# EAGLE design minimal_arduino (EAGLE 6.2)
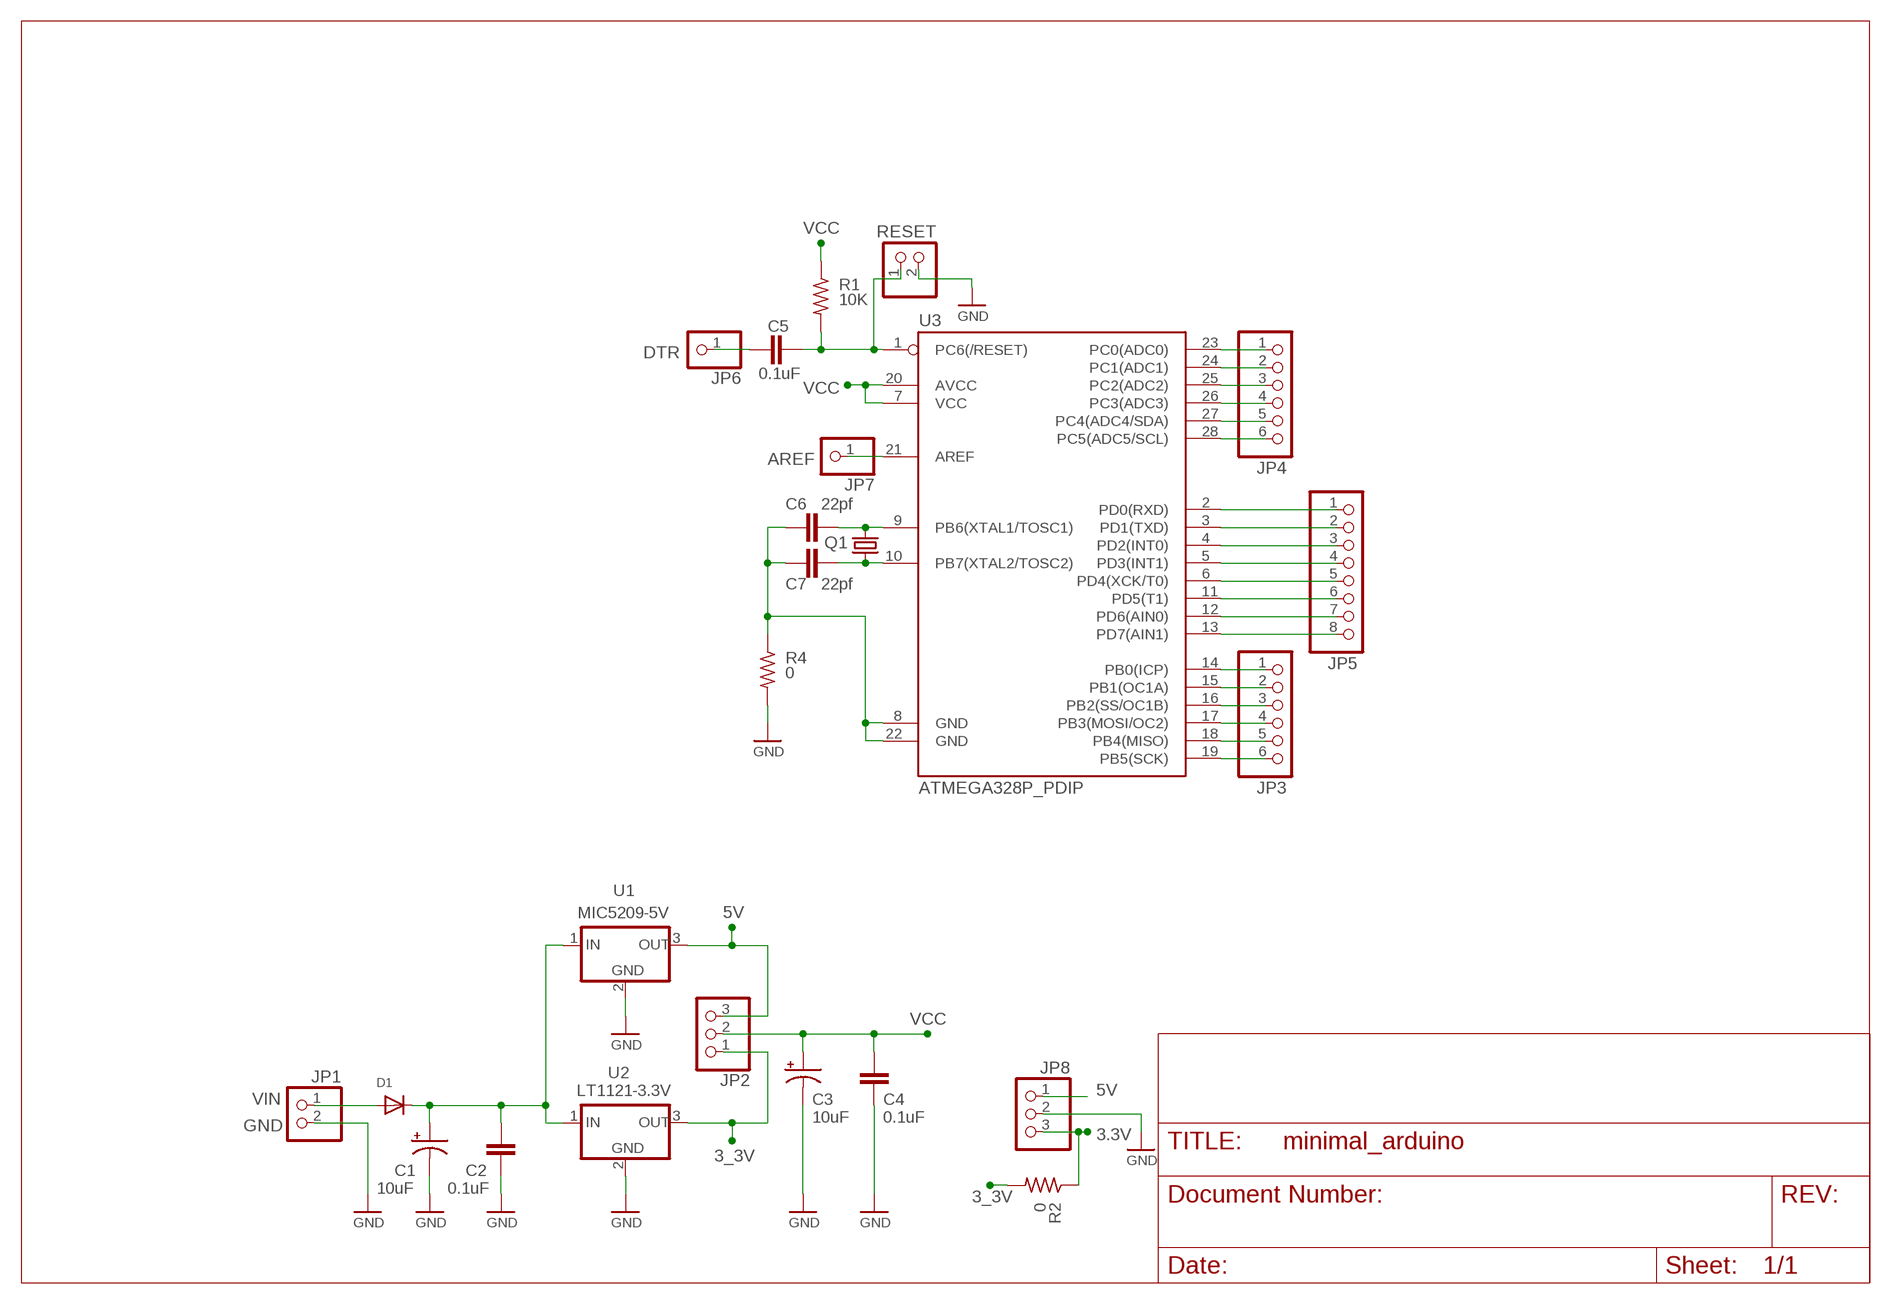
[diagram p0: schematic, sheet 1]

## Parts
C1  10uF  CPOL-USCT3528  [CT3528]
C2  0.1uF  C-EU  [CT3216]
C3  10uF  CPOL-USCT3528  [CT3528]
C4  0.1uF  C-EU  [CT3216]
C5  0.1uF  C-EU  [CT3216]
C6  22pf  C-EU  [CT3216]
C7  22pf  C-EU  [CT3216]
D1  DIODESMA  [SMADIODE]
JP1  PINHD-1X2  [1X02]
JP2  PINHD-1X3  [1X03]
JP3  PINHD-1X6  [1X06]
JP4  PINHD-1X6  [1X06]
JP5  PINHD-1X8  [1X08]
JP6  PINHD-1X1  [1X01]
JP7  PINHD-1X1  [1X01]
JP8  PINHD-1X3  [1X03]
Q1  CRYSTALHC18U-V  [HC18U-V]
R1  10K  R-US_M1406  [M1406]
R2  0  R-US_M1406  [M1406]
R4  0  R-US_M1406  [M1406]
RESET  PINHD-1X2  [1X02]
U1  MIC5209-5V  MIC5209  [SOT223_LT]
U2  LT1121-3.3V  LT1121-3.3VSOT223-LT  [SOT223_LT]
U3  ATMEGA328P_PDIP  [DIL28-3]

## Nets
3.3V: JP8.3 R2.1
3_3V: JP2.1 R2.2 U2.3(VO)
5V: JP2.3 JP8.1 U1.3(VO)
AREF: JP7.1 U3.21(AREF)
DTR: C5.+ JP6.1
GND: C1.- C2.- C3.- C4.- JP1.2 JP8.2 R4.2 RESET.2 U1.2(GND) U2.2(GND)
N$1: C5.- R1.2 RESET.1 U3.1(PC6(/RESET))
N$3: C6.+ C7.+ R4.1 U3.8(GND) U3.22(GND)
N$5: C6.- Q1.2 U3.9(PB6(XTAL1/TOSC1))
N$8: C7.- Q1.1 U3.10(PB7(XTAL2/TOSC2))
N$9: JP3.1 U3.14(PB0(ICP))
N$10: JP3.2 U3.15(PB1(OC1A))
N$11: JP3.3 U3.16(PB2(SS/OC1B))
N$12: JP3.4 U3.17(PB3(MOSI/OC2))
N$13: JP3.5 U3.18(PB4(MISO))
N$14: JP3.6 U3.19(PB5(SCK))
N$15: JP4.6 U3.28(PC5(ADC5/SCL))
N$16: JP4.5 U3.27(PC4(ADC4/SDA))
N$17: JP4.4 U3.26(PC3(ADC3))
N$18: JP4.3 U3.25(PC2(ADC2))
N$19: JP4.2 U3.24(PC1(ADC1))
N$20: JP4.1 U3.23(PC0(ADC0))
N$21: JP5.1 U3.2(PD0(RXD))
N$22: JP5.2 U3.3(PD1(TXD))
N$23: JP5.3 U3.4(PD2(INT0))
N$24: JP5.4 U3.5(PD3(INT1))
N$25: JP5.5 U3.6(PD4(XCK/T0))
N$26: JP5.6 U3.11(PD5(T1))
N$27: JP5.7 U3.12(PD6(AIN0))
N$28: JP5.8 U3.13(PD7(AIN1))
V_IN: C1.+ C2.+ D1.C U1.1(VI) U2.1(VI)
VCC: C3.+ C4.+ JP2.2 R1.1 U3.7(VCC) U3.20(AVCC)
VIN: D1.A JP1.1

## Library data of the parts
C1 C3 = rcl:CPOL-US: POLARIZED CAPACITOR, American symbol
C2 C4-C7 = rcl:C-EU: CAPACITOR, European symbol
D1 = adafruit:DIODE: Diode SMADIODE - SMA Surface Mount Package 20V 1A Schottky Diode Digikey: 641-1014-6-ND DO-1N4148 - Through Hole Small Current Diode SOD-123 20V 1 A (.5mV Vf) Schottky Diode - Digikey: MBRX120TPMSCT-ND SOD-323 10V 570mA (.38mV Vf, 3ns) Schottky Diode - Digikey: ZLLS410CT-ND SOD-523 30V 30mA Schottky Diode (RB751S-40TE61) - Digikey: RB751S-40TE61CT-ND SOT23-R/W - SOT23 Package (R = Solder Paste/Reflow Ovens, W = Hand-Soldering) BAT54Film 40V 300mA - Digikey: 497-7162-1-ND
JP1 RESET = pinhead_mod:PINHD-1X2: PIN HEADER
JP2 JP8 = pinhead_mod:PINHD-1X3: PIN HEADER
JP3 JP4 = pinhead_mod:PINHD-1X6: PIN HEADER
JP5 = pinhead_mod:PINHD-1X8: PIN HEADER
JP6 JP7 = pinhead_mod:PINHD-1X1: PIN HEADER
Q1 = crystal:CRYSTAL: CRYSTAL; OC_FARNELL: unknown; OC_NEWARK: unknown
R1 R2 R4 = rcl:R-US_: RESISTOR, American symbol
U1 = surekha:MIC5209
U2 = v-reg:LT1121-3.3V: Lt1121-3.3v
U3 = SparkFun-DigitalIC:ATMEGA328P_PDIP: uC used in the Arduino 32kb flash, 1k EEPROM, 2k SRAM This is the through-hole version of this chip.

## Board
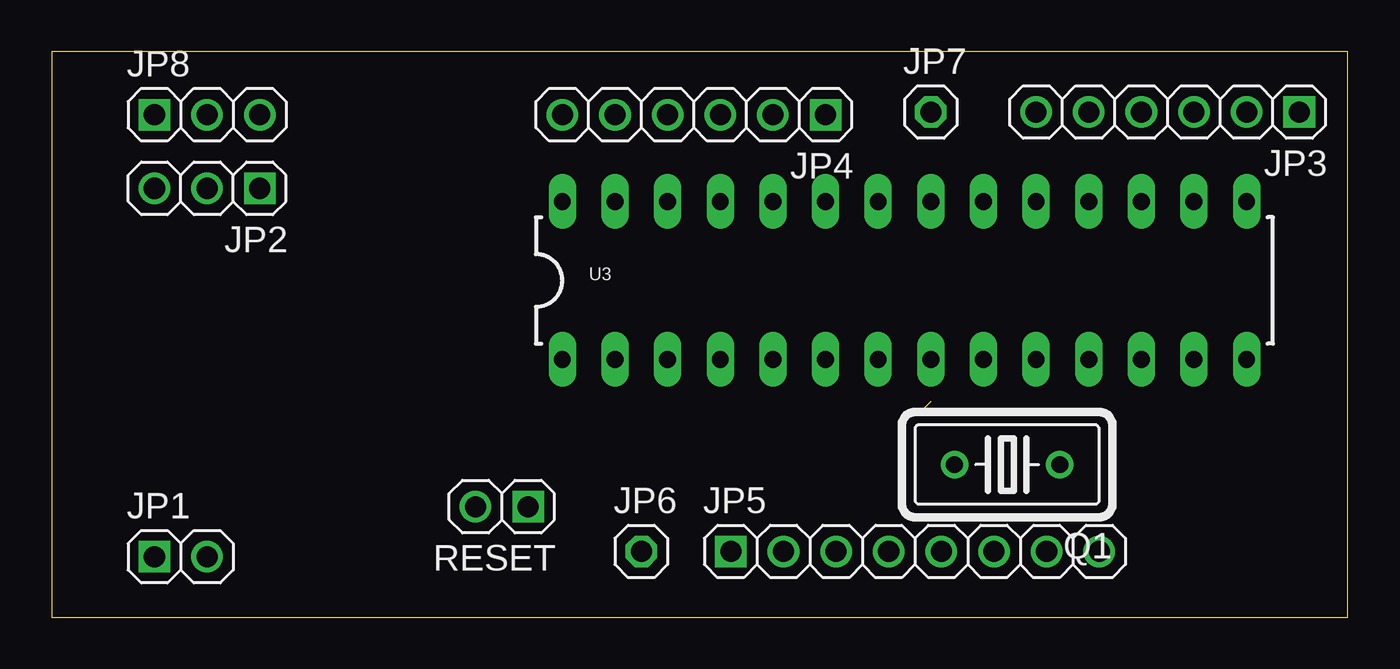
[diagram p1: board, top side]
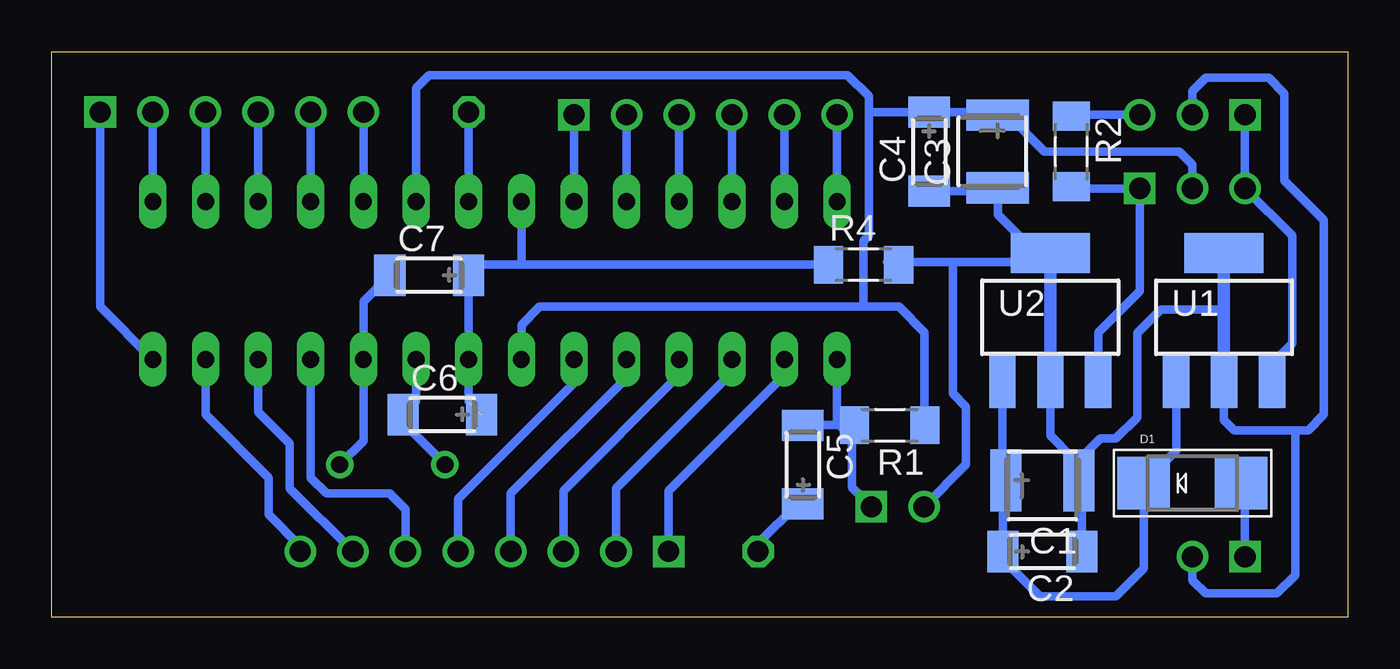
[diagram p2: board, bottom side, seen from below]

Size 62.53 x 27.3 mm. Coordinates in mm from the lower left corner, seen from the top.
Outline: 0,0 62.53,0 62.53,27.3 0,27.3 0,0
Copper layers (1*16): Top 0.035mm / dielectric 1.5mm / Bottom 0.035mm
Design rules: minimum track width 10mil, minimum drill 24mil, track to track 8mil, track to pad 8mil, pad to pad 8mil, via to via 8mil, smd to smd 8mil, copper to edge 40mil, drill to drill 8mil, minimum pad ring 10mil, minimum via ring 8mil, stop-mask expansion 4mil, vias tented up to drill 0mil, thermal gap 10mil

### Footprints (pad centres in the part's own frame; a part is rotated, then mirrored left to right if it is on the bottom)
CT3528 = smd 1.5 x 3: + 1.754,0; - -1.754,0
CT3216 = smd 1.5 x 2: + 1.9,0; - -1.9,0
SMADIODE = smd 2.54 x 2.54: A 2.349,0; C -2.349,0
1X02 = drill 1.016 square: 1 -1.27,0 | drill 1.016: 2 1.27,0
1X03 = drill 1.016 square: 1 -2.54,0 | drill 1.016: 2 0,0; 3 2.54,0
1X06 = drill 1.016 square: 1 -6.35,0 | drill 1.016: 2 -3.81,0; 3 -1.27,0; 4 1.27,0; 5 3.81,0; 6 6.35,0
1X08 = drill 1.016 square: 1 -8.89,0 | drill 1.016: 2 -6.35,0; 3 -3.81,0; 4 -1.27,0; 5 1.27,0; 6 3.81,0; 7 6.35,0; 8 8.89,0
1X01 = drill 1.016 octagon: 1 0,0
HC18U-V = drill 0.813: 1 -2.54,0; 2 2.54,0
M1406 = smd 1.4 x 1.8: 1 -1.7,0; 2 1.7,0
SOT223_LT = smd 1.27 x 2.54: 1 -2.311,-3.099; 2 0,-3.099; 3 2.311,-3.099 | smd 3.81 x 1.93: 4 0,3.099
DIL28-3 = drill 0.813 long: 1 -16.51,-3.81; 2 -13.97,-3.81; 3 -11.43,-3.81; 4 -8.89,-3.81; 5 -6.35,-3.81; 6 -3.81,-3.81; 7 -1.27,-3.81; 8 1.27,-3.81; 9 3.81,-3.81; 10 6.35,-3.81; 11 8.89,-3.81; 12 11.43,-3.81; 13 13.97,-3.81; 14 16.51,-3.81; 15 16.51,3.81; 16 13.97,3.81; 17 11.43,3.81; 18 8.89,3.81; 19 6.35,3.81; 20 3.81,3.81; 21 1.27,3.81; 22 -1.27,3.81; 23 -3.81,3.81; 24 -6.35,3.81; 25 -8.89,3.81; 26 -11.43,3.81; 27 -13.97,3.81; 28 -16.51,3.81

### Placement (x,y rotation side)
C1  14.73,6.6 180 bottom
C2  14.73,3.17 180 bottom
C3  16.89,22.48 90 bottom
C4  20.19,22.48 90 bottom
C5  26.29,7.37 270 bottom
C6  43.69,9.78 0 bottom
C7  44.32,16.51 0 bottom
D1  7.49,6.48 0 bottom
JP1  6.22,2.92 0 top
JP2  7.49,20.7 180 top
JP3  53.85,24.38 180 top
JP4  30.99,24.26 180 top
JP5  41.66,3.17 0 top
JP6  28.45,3.17 0 top
JP7  42.42,24.38 0 top
JP8  7.49,24.26 0 top
Q1  46.1,7.37 180 top
R1  22.1,9.27 180 bottom
R2  13.34,22.48 270 bottom
R4  23.37,17.02 0 bottom
RESET  21.72,5.33 180 top
U1  5.97,14.48 0 bottom
U2  14.35,14.48 0 bottom
U3  41.15,16.26 0 top

### Tracks (layer width: path | path; a pad name or v marks a point on that pad's centre or on a via)
3.3V
  Bottom 0.406: JP8.3 13.26,24.26 R2.1
3_3V
  Bottom 0.406: U2.3 12.04,13.74 10.03,15.75 JP2.1 13.26,20.7 R2.2
5V
  Bottom 0.406: U1.3 3.66,12.22 2.67,13.21 2.67,18.41 JP2.3 JP8.1
AREF
  Bottom 0.406: JP7.1 U3.21
DTR
  Bottom 0.406: C5.+ 26.54,5.47 28.45,3.56 JP6.1
GND
  Bottom 0.406: 2.54,9.02 2.54,2.03 3.43,1.14 6.86,1.14 7.49,1.78 JP1.2 | 2.54,9.02 5.46,9.02 5.97,9.53 U1.2 5.97,14.86 9.02,14.86 10.16,13.72 10.16,9.65 11.18,8.64 11.94,8.64 12.57,8 12.57,7.01 C1.- | 2.54,9.02 1.91,9.02 1.14,9.78 1.14,19.18 3.05,21.08 3.05,25.27 3.81,26.04 6.86,26.04 7.49,25.4 JP8.2 | C2.- 12.83,6.46 C1.- | C1.- 12.98,7.34 | C1.- 13.34,6.96 13.34,7.75 14.35,8.76 U2.2 14.35,17.14 | 14.35,17.14 14.35,17.27 14.61,17.53 14.99,17.53 16.89,19.43 C3.- 17.04,20.58 C4.- | RESET.2 18.41,7.37 18.41,10.16 19.05,10.79 19.05,17.14 | 19.05,17.14 22.23,17.14 22.1,17.02 R4.2 | 19.05,17.14 14.35,17.14
N$1
  Bottom 0.406: U3.1 24.64,9.4 24.38,9.14 23.93,9.14 | 23.93,9.14 R1.2 C5.- | 23.93,9.14 23.93,6.27 RESET.1
N$3  (1 unrouted)
  Bottom 0.406: 42.42,10.41 U3.8 42.42,14.47 42.42,14.48 C7.+ 41.91,17.02 40.01,17.02 | R4.1 40.01,17.02 | U3.22 39.88,17.14 40.01,17.02
N$5
  Bottom 0.406: U3.9 44.96,10.41 C6.- 45.59,9.39 Q1.2
N$8
  Bottom 0.406: Q1.1 47.5,8.51 U3.10 47.5,15.23 C7.-
N$9
  Bottom 0.406: JP3.1 60.2,14.99 U3.14
N$10
  Bottom 0.406: JP3.2 U3.15
N$11
  Bottom 0.406: JP3.3 U3.16
N$12
  Bottom 0.406: JP3.4 U3.17
N$13
  Bottom 0.406: JP3.5 U3.18
N$14
  Bottom 0.406: JP3.6 U3.19
N$15
  Bottom 0.406: JP4.6 U3.28
N$16
  Bottom 0.406: JP4.5 U3.27
N$17
  Bottom 0.406: JP4.4 U3.26
N$18
  Bottom 0.406: JP4.3 U3.25
N$19
  Bottom 0.406: JP4.2 U3.24
N$20
  Bottom 0.406: JP4.1 U3.23
N$21
  Bottom 0.406: JP5.1 32.77,6.1 27.18,11.68 U3.2
N$22
  Bottom 0.406: U3.3 29.72,11.81 35.31,6.22 JP5.2
N$23
  Bottom 0.406: U3.4 32.26,11.68 37.85,6.1 JP5.3
N$24
  Bottom 0.406: U3.5 34.8,11.56 40.39,5.97 JP5.4
N$25
  Bottom 0.406: JP5.5 42.93,5.71 37.34,11.3 U3.6
N$26
  Bottom 0.406: U3.11 50.04,6.73 49.28,5.97 46.23,5.97 45.47,5.21 JP5.6
N$27
  Bottom 0.406: U3.12 52.58,9.91 51.05,8.38 51.05,6.22 JP5.7
N$28
  Bottom 0.406: U3.13 55.12,9.78 52.07,6.73 52.07,4.95 50.55,3.43 JP5.8
V_IN
  Bottom 0.406: U1.1 8.28,8.04 D1.C 9.84,2.35 11.18,1.02 14.86,1.02 16.63,2.79 C2.+ arc90 C2.+ 16.64,6.1 | 16.64,6.1 16.64,6.45 C1.+ | U2.1 16.66,6.12 16.64,6.1
VCC
  Bottom 0.406: U3.7 39.88,14.1 38.99,14.99 23.37,14.99 | JP2.2 7.49,21.84 8.13,22.48 14.63,22.48 16.38,24.23 C3.+ 17.04,24.38 C4.+ 23.11,24.38 | 20.53,9.61 20.06,9.61 R1.1 20.42,9.27 20.42,13.74 21.67,14.99 23.37,14.99 | 23.37,14.99 23.37,18.16 23.11,18.41 23.11,24.38 | U3.20 44.96,25.53 44.32,26.16 24.13,26.16 23.11,25.15 23.11,24.38
VIN
  Bottom 0.406: JP1.1 4.95,5.97 5.14,6.16 D1.A